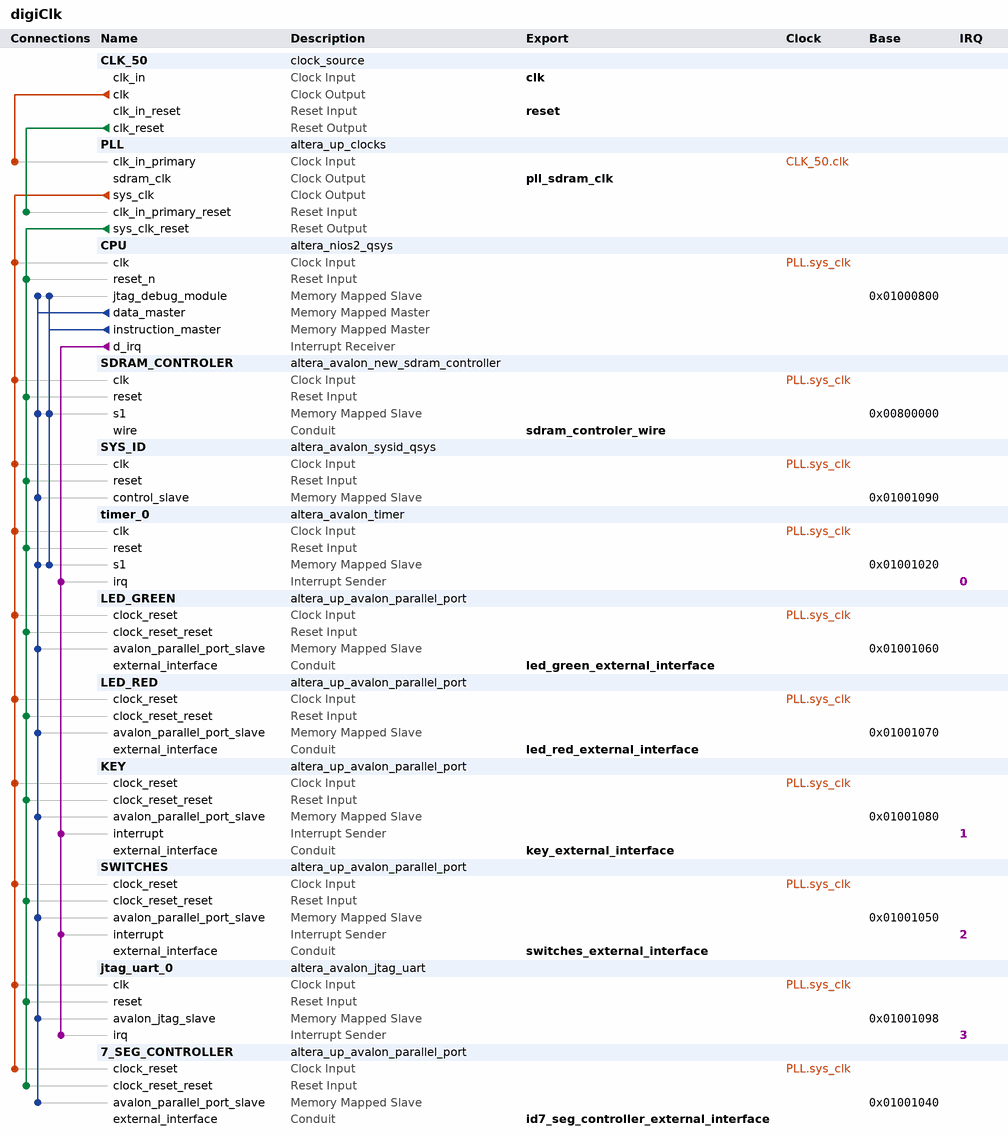
[diagram p0: system contents]
# Platform Designer (Qsys) system digiClk, Cyclone II EP2C20F484C7
# Parameters at their usual value, and those the tool derives, are not listed.
package require -exact qsys 13.0
create_system digiClk
set_project_property DEVICE_FAMILY {Cyclone II}
set_project_property DEVICE EP2C20F484C7

add_instance CLK_50 clock_source 13.0
set_instance_parameter_value CLK_50 clockFrequency 50000000

add_instance PLL altera_up_clocks 13.0
set_instance_parameter_value PLL board DE1
set_instance_parameter_value PLL vga_clk false
set_instance_parameter_value PLL audio_clk false
set_instance_parameter_value PLL audio_clk_freq 12.288

add_instance CPU altera_nios2_qsys 13.0
set_instance_parameter_value CPU resetSlave SDRAM_CONTROLER.s1
set_instance_parameter_value CPU mmu_TLBMissExcSlave None
set_instance_parameter_value CPU exceptionSlave SDRAM_CONTROLER.s1
set_instance_parameter_value CPU breakSlave CPU.jtag_debug_module
set_instance_parameter_value CPU impl Tiny
set_instance_parameter_value CPU icache_size 4096

add_instance SDRAM_CONTROLER altera_avalon_new_sdram_controller 13.0.1.99.2
set_instance_parameter_value SDRAM_CONTROLER TAC 5.5
set_instance_parameter_value SDRAM_CONTROLER TRCD 20.0
set_instance_parameter_value SDRAM_CONTROLER TRP 20.0
set_instance_parameter_value SDRAM_CONTROLER casLatency 3
set_instance_parameter_value SDRAM_CONTROLER columnWidth 8
set_instance_parameter_value SDRAM_CONTROLER dataWidth 16
set_instance_parameter_value SDRAM_CONTROLER generateSimulationModel false
set_instance_parameter_value SDRAM_CONTROLER model single_Micron_MT48LC4M32B2_7_chip
set_instance_parameter_value SDRAM_CONTROLER numberOfBanks 4
set_instance_parameter_value SDRAM_CONTROLER numberOfChipSelects 1
set_instance_parameter_value SDRAM_CONTROLER powerUpDelay 100.0
set_instance_parameter_value SDRAM_CONTROLER refreshPeriod 15.625
set_instance_parameter_value SDRAM_CONTROLER rowWidth 12

add_instance SYS_ID altera_avalon_sysid_qsys 13.0
set_instance_parameter_value SYS_ID id 0

add_instance timer_0 altera_avalon_timer 13.0.1.99.2
set_instance_parameter_value timer_0 period 1
set_instance_parameter_value timer_0 periodUnits SEC

add_instance LED_GREEN altera_up_avalon_parallel_port 13.0
set_instance_parameter_value LED_GREEN board DE1
set_instance_parameter_value LED_GREEN preset LEDs
set_instance_parameter_value LED_GREEN capture false
set_instance_parameter_value LED_GREEN edge Rising
set_instance_parameter_value LED_GREEN irq false

add_instance LED_RED altera_up_avalon_parallel_port 13.0
set_instance_parameter_value LED_RED board DE1
set_instance_parameter_value LED_RED preset LEDs
set_instance_parameter_value LED_RED leds Red
set_instance_parameter_value LED_RED capture false
set_instance_parameter_value LED_RED edge Rising
set_instance_parameter_value LED_RED irq false

add_instance KEY altera_up_avalon_parallel_port 13.0
set_instance_parameter_value KEY board DE1
set_instance_parameter_value KEY preset Pushbuttons
set_instance_parameter_value KEY capture true
set_instance_parameter_value KEY edge Rising
set_instance_parameter_value KEY irq true

add_instance SWITCHES altera_up_avalon_parallel_port 13.0
set_instance_parameter_value SWITCHES board DE1
set_instance_parameter_value SWITCHES preset {Slider Switches}
set_instance_parameter_value SWITCHES capture true
set_instance_parameter_value SWITCHES edge Rising
set_instance_parameter_value SWITCHES irq true

add_instance jtag_uart_0 altera_avalon_jtag_uart 13.0.1.99.2
set_instance_parameter_value jtag_uart_0 simInteractiveOptions NO_INTERACTIVE_WINDOWS

add_instance 7_SEG_CONTROLLER altera_up_avalon_parallel_port 13.0
set_instance_parameter_value 7_SEG_CONTROLLER board DE1
set_instance_parameter_value 7_SEG_CONTROLLER preset {Seven Segment Displays}
set_instance_parameter_value 7_SEG_CONTROLLER capture false
set_instance_parameter_value 7_SEG_CONTROLLER edge Rising
set_instance_parameter_value 7_SEG_CONTROLLER irq false

# connections
add_connection CLK_50.clk PLL.clk_in_primary clock
add_connection PLL.sys_clk 7_SEG_CONTROLLER.clock_reset clock
add_connection PLL.sys_clk CPU.clk clock
add_connection PLL.sys_clk jtag_uart_0.clk clock
add_connection PLL.sys_clk KEY.clock_reset clock
add_connection PLL.sys_clk LED_GREEN.clock_reset clock
add_connection PLL.sys_clk LED_RED.clock_reset clock
add_connection PLL.sys_clk SDRAM_CONTROLER.clk clock
add_connection PLL.sys_clk SWITCHES.clock_reset clock
add_connection PLL.sys_clk SYS_ID.clk clock
add_connection PLL.sys_clk timer_0.clk clock
add_connection CLK_50.clk_reset PLL.clk_in_primary_reset reset
add_connection PLL.sys_clk_reset 7_SEG_CONTROLLER.clock_reset_reset reset
add_connection PLL.sys_clk_reset CPU.reset_n reset
add_connection PLL.sys_clk_reset jtag_uart_0.reset reset
add_connection PLL.sys_clk_reset KEY.clock_reset_reset reset
add_connection PLL.sys_clk_reset LED_GREEN.clock_reset_reset reset
add_connection PLL.sys_clk_reset LED_RED.clock_reset_reset reset
add_connection PLL.sys_clk_reset SDRAM_CONTROLER.reset reset
add_connection PLL.sys_clk_reset SWITCHES.clock_reset_reset reset
add_connection PLL.sys_clk_reset SYS_ID.reset reset
add_connection PLL.sys_clk_reset timer_0.reset reset
add_connection CPU.data_master 7_SEG_CONTROLLER.avalon_parallel_port_slave avalon
set_connection_parameter_value CPU.data_master/7_SEG_CONTROLLER.avalon_parallel_port_slave baseAddress 0x01001040
add_connection CPU.data_master CPU.jtag_debug_module avalon
set_connection_parameter_value CPU.data_master/CPU.jtag_debug_module baseAddress 0x01000800
add_connection CPU.data_master jtag_uart_0.avalon_jtag_slave avalon
set_connection_parameter_value CPU.data_master/jtag_uart_0.avalon_jtag_slave baseAddress 0x01001098
add_connection CPU.data_master KEY.avalon_parallel_port_slave avalon
set_connection_parameter_value CPU.data_master/KEY.avalon_parallel_port_slave baseAddress 0x01001080
add_connection CPU.data_master LED_GREEN.avalon_parallel_port_slave avalon
set_connection_parameter_value CPU.data_master/LED_GREEN.avalon_parallel_port_slave baseAddress 0x01001060
add_connection CPU.data_master LED_RED.avalon_parallel_port_slave avalon
set_connection_parameter_value CPU.data_master/LED_RED.avalon_parallel_port_slave baseAddress 0x01001070
add_connection CPU.data_master SDRAM_CONTROLER.s1 avalon
set_connection_parameter_value CPU.data_master/SDRAM_CONTROLER.s1 baseAddress 0x00800000
add_connection CPU.data_master SWITCHES.avalon_parallel_port_slave avalon
set_connection_parameter_value CPU.data_master/SWITCHES.avalon_parallel_port_slave baseAddress 0x01001050
add_connection CPU.data_master SYS_ID.control_slave avalon
set_connection_parameter_value CPU.data_master/SYS_ID.control_slave baseAddress 0x01001090
add_connection CPU.data_master timer_0.s1 avalon
set_connection_parameter_value CPU.data_master/timer_0.s1 baseAddress 0x01001020
add_connection CPU.instruction_master CPU.jtag_debug_module avalon
set_connection_parameter_value CPU.instruction_master/CPU.jtag_debug_module baseAddress 0x01000800
add_connection CPU.instruction_master SDRAM_CONTROLER.s1 avalon
set_connection_parameter_value CPU.instruction_master/SDRAM_CONTROLER.s1 baseAddress 0x00800000
add_connection CPU.instruction_master timer_0.s1 avalon
set_connection_parameter_value CPU.instruction_master/timer_0.s1 baseAddress 0x01001020
add_connection CPU.d_irq jtag_uart_0.irq interrupt
set_connection_parameter_value CPU.d_irq/jtag_uart_0.irq irqNumber 3
add_connection CPU.d_irq KEY.interrupt interrupt
set_connection_parameter_value CPU.d_irq/KEY.interrupt irqNumber 1
add_connection CPU.d_irq SWITCHES.interrupt interrupt
set_connection_parameter_value CPU.d_irq/SWITCHES.interrupt irqNumber 2
add_connection CPU.d_irq timer_0.irq interrupt
set_connection_parameter_value CPU.d_irq/timer_0.irq irqNumber 0

# exported interfaces
add_interface reset reset sink
set_interface_property reset EXPORT_OF CLK_50.clk_in_reset
add_interface sdram_controler_wire conduit end
set_interface_property sdram_controler_wire EXPORT_OF SDRAM_CONTROLER.wire
add_interface clk clock sink
set_interface_property clk EXPORT_OF CLK_50.clk_in
add_interface switches_external_interface conduit end
set_interface_property switches_external_interface EXPORT_OF SWITCHES.external_interface
add_interface key_external_interface conduit end
set_interface_property key_external_interface EXPORT_OF KEY.external_interface
add_interface led_red_external_interface conduit end
set_interface_property led_red_external_interface EXPORT_OF LED_RED.external_interface
add_interface led_green_external_interface conduit end
set_interface_property led_green_external_interface EXPORT_OF LED_GREEN.external_interface
add_interface id7_seg_controller_external_interface conduit end
set_interface_property id7_seg_controller_external_interface EXPORT_OF 7_SEG_CONTROLLER.external_interface
add_interface pll_sdram_clk clock source
set_interface_property pll_sdram_clk EXPORT_OF PLL.sdram_clk

set_interconnect_requirement {$system} qsys_mm.clockCrossingAdapter HANDSHAKE
set_interconnect_requirement {$system} qsys_mm.maxAdditionalLatency 1

save_system digiClk.qsys
